# EAGLE design PCM2906_SPDIF_Converter (EAGLE 7.4.0)
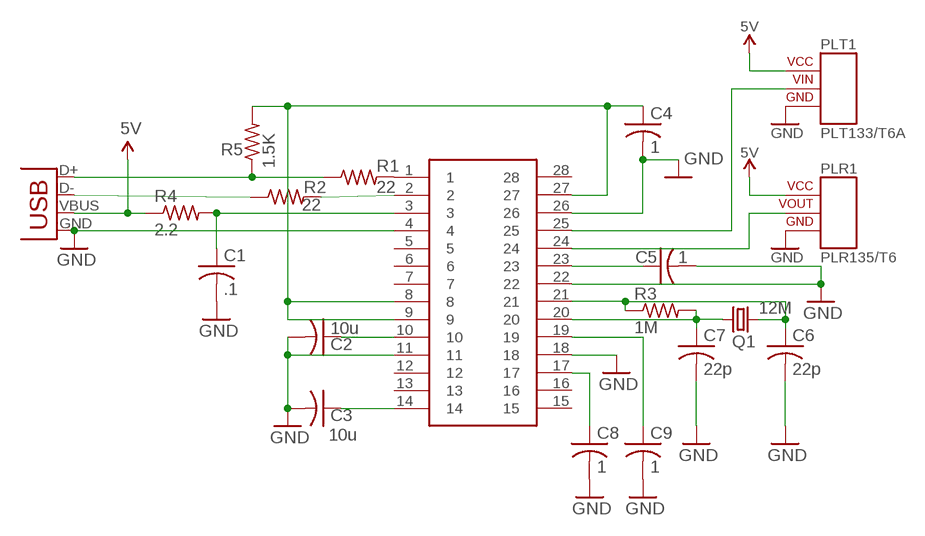
[diagram p0: schematic, sheet 1]

## Parts
C1  .1  C-USC0805  [C0805]
C2  10u  C-USC1210  [C1210]
C3  10u  C-USC1210  [C1210]
C4  1  C-USC1210  [C1210]
C5  1  C-USC1210  [C1210]
C6  22p  C-USC0805  [C0805]
C7  22p  C-USC0805  [C0805]
C8  1  C-USC1210  [C1210]
C9  1  C-USC1210  [C1210]
PCM2906  SSOP28  [SSOP28DB]
PLR1  PLR135/T6  [PLR135/T6]
PLT1  PLT133/T6A  [PLT133/T6A]
Q1  12M  CRYSTALHC49US  [HC49US]
R1  22  R-US_R0805  [R0805]
R2  22  R-US_R0805  [R0805]
R3  1M  R-US_R0805  [R0805]
R4  2.2  R-US_R0805  [R0805]
R5  1.5K  R-US_R0805  [R0805]
X2  USBSMD  [USB-MINIB]

## Nets
5V: PLR1.VCC PLT1.VCC R4.1 X2.VBUS
GND: C1.2 C2.2 C3.2 C4.2 C5.2 C6.2 C7.2 C8.2 C9.2 PCM2906.4 PCM2906.11 PCM2906.18 PCM2906.22 PCM2906.26 PLR1.GND PLT1.GND X2.GND
N$1: PCM2906.1 R1.2
N$2: PCM2906.2 R2.2
N$3: C6.1 PCM2906.21 Q1.2 R3.1
N$4: R1.1 R5.1 X2.D+
N$5: R2.1 X2.D-
N$7: PCM2906.24 PLR1.VOUT
N$8: C4.1 PCM2906.8 PCM2906.9 PCM2906.27 R5.2
N$9: C5.1 PCM2906.23
N$10: C2.1 PCM2906.10
N$11: C3.1 PCM2906.14
N$12: C1.1 PCM2906.3 R4.2
N$13: PCM2906.25 PLT1.VIN
N$14: C8.1 PCM2906.17
N$16: C9.1 PCM2906.19
N$19: C7.1 PCM2906.20 Q1.1 R3.2
Unconnected: PCM2906.5 PCM2906.6 PCM2906.7 PCM2906.12 PCM2906.13 PCM2906.15 PCM2906.16 PCM2906.28

## Library data of the parts
C1-C9 = resistor:C-US: CAPACITOR, American symbol
PCM2906 = SparkFun:SSOP28
PLR1 = Joseph_Optoelectronics:PLR135/T6
PLT1 = Joseph_Optoelectronics:PLT133: Photo-link Light Transmitter Unit www.everlight.com Replacement for the PLT133/T6A
Q1 = SparkFun:CRYSTAL: Crystals Various standard crystals. Proven footprints. Spark Fun Electronics SKU : COM-00534
R1-R5 = resistor:R-US_: RESISTOR, American symbol
X2 = SparkFun:USB: USB Connectors USB-B-PTH is fully proven SKU : PRT-00139 USB-miniB is fully proven SKU : PRT-00587 USB-A-PCB is untested. USB-A-H is throughly reviewed, but untested. Spark Fun Electronics SKU : PRT-00437 USB-B-SMT is throughly reviewed, but untested. Needs silkscreen touching up. USB-A-S has not been used/tested USB-MB-H has not been used/tested

## Board
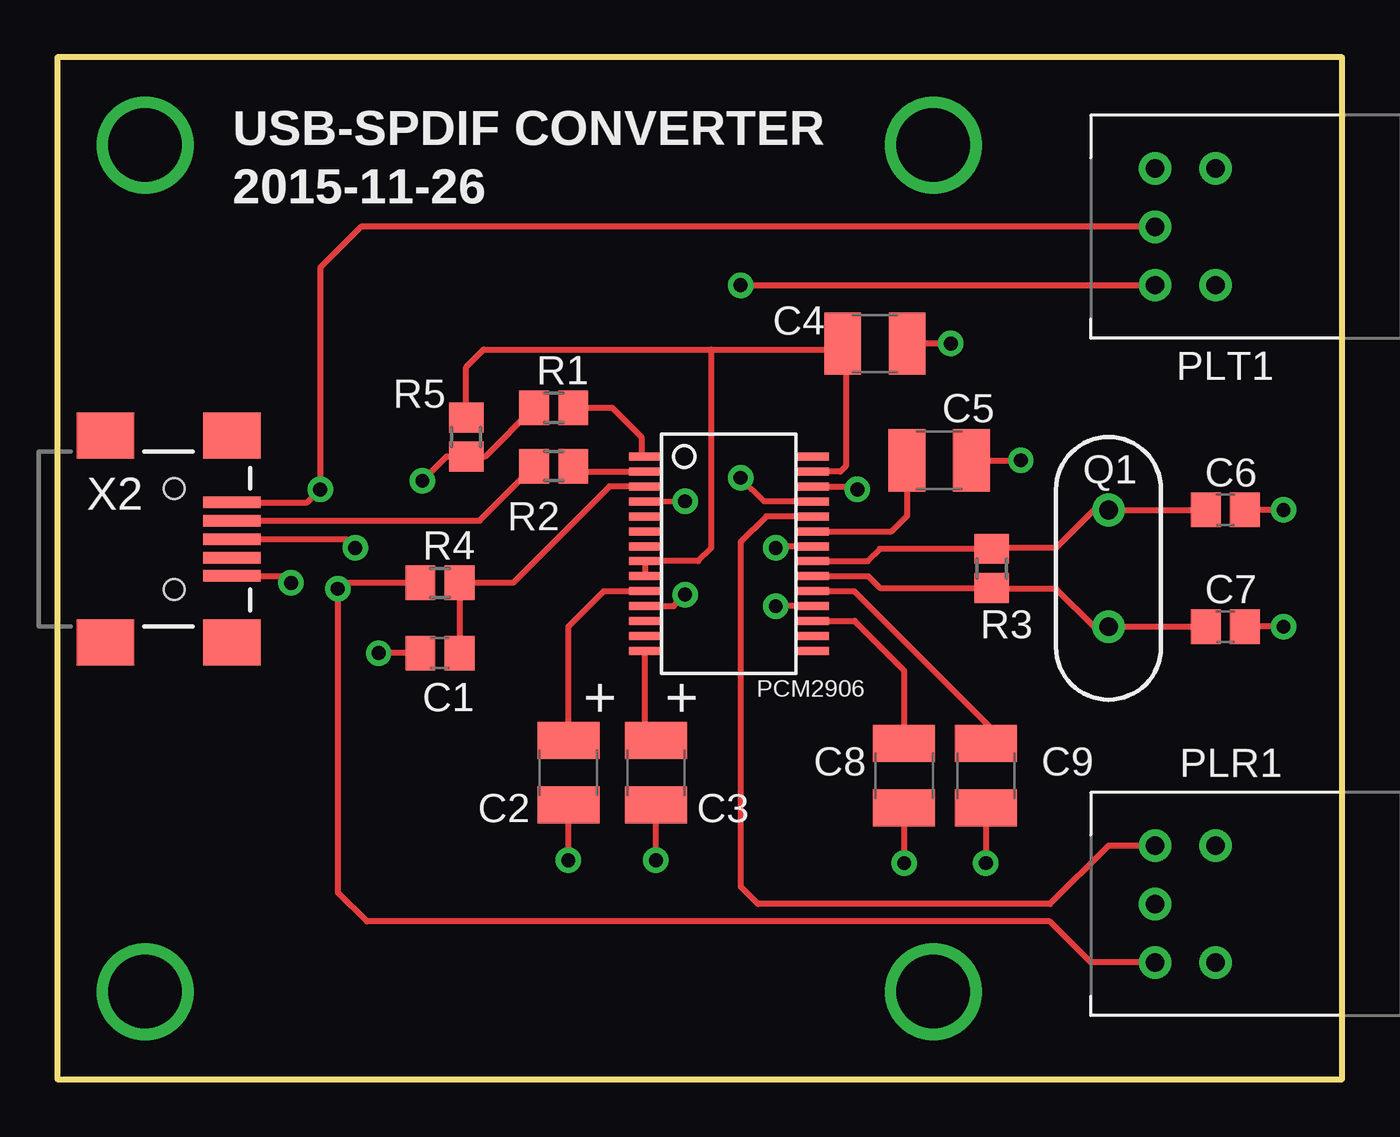
[diagram p1: board, top side]
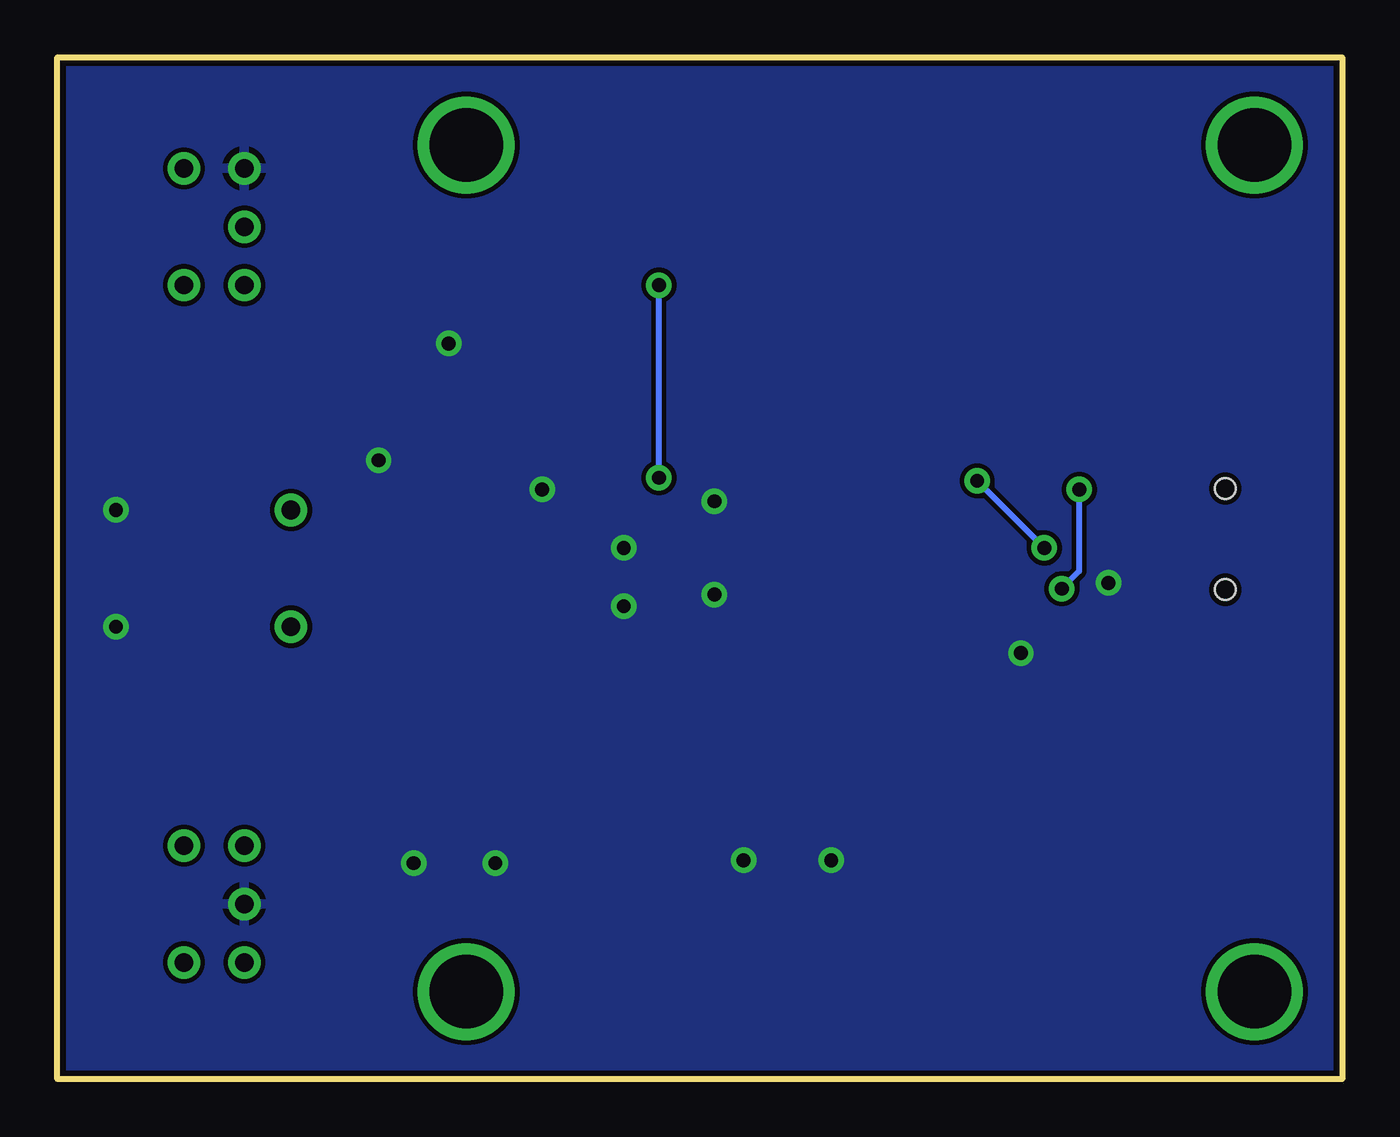
[diagram p2: board, bottom side, seen from below]

Size 55.88 x 44.45 mm. Coordinates in mm from the lower left corner, seen from the top.
Outline: 0,0 55.88,0 55.88,44.45 0,44.45 0,0
Copper layers (1*16): Top 0.035mm / dielectric 1.5mm / Bottom 0.035mm
Design rules "SparkFun": minimum track width 8mil, minimum drill 20mil, track to track 8mil, track to pad 8mil, pad to pad 8mil, via to via 8mil, smd to smd 8mil, copper to edge 10mil, drill to drill 8mil, minimum pad ring 12mil, minimum via ring 10mil, stop-mask expansion 4mil, vias tented up to drill 25mil, thermal gap 10mil

### Footprints (pad centres in the part's own frame; a part is rotated, then mirrored left to right if it is on the bottom)
C0805 = smd 1.3 x 1.5: 1 -0.85,0; 2 0.85,0
C1210 = smd 1.6 x 2.7: 1 -1.4,0; 2 1.4,0
SSOP28DB = smd 0.348 x 1.397: 1 -4.225,-3.656; 2 -3.575,-3.656; 3 -2.925,-3.656; 4 -2.275,-3.656; 5 -1.625,-3.656; 6 -0.975,-3.656; 7 -0.325,-3.656; 8 0.325,-3.656; 9 0.975,-3.656; 10 1.625,-3.656; 11 2.275,-3.656; 12 2.925,-3.656; 13 3.575,-3.656; 14 4.225,-3.656; 15 4.225,3.656; 16 3.575,3.656; 17 2.925,3.656; 18 2.275,3.656; 19 1.625,3.656; 20 0.975,3.656; 21 0.325,3.656; 22 -0.325,3.656; 23 -0.975,3.656; 24 -1.625,3.656; 25 -2.275,3.656; 26 -2.925,3.656; 27 -3.575,3.656; 28 -4.225,3.656
PLR135/T6 = drill 0.8: GND 0,0; P$4 -2.54,2.625; P$5 2.54,2.625; VCC 2.54,0; VOUT -2.54,0
PLT133/T6A = drill 0.8: GND -2.54,0; P$1 -2.54,2.625; P$4 -2.54,2.625; P$5 2.54,2.625; VCC 0,0; VIN 2.54,0
HC49US = drill 0.813: 1 -2.54,0; 2 2.54,0
R0805 = smd 1.3 x 1.5: 1 -0.85,0; 2 0.85,0
USB-MINIB = smd 2.5 x 0.5: D+ 2.5,0; D- 2.5,0.8; GND 2.5,-1.6; ID 2.5,-0.8; VBUS 2.5,1.6 | smd 2.5 x 2: GND@1 -3,-4.5; GND@2 -3,4.5; GND@3 2.5,4.5; GND@4 2.5,-4.5 | hole 0.9: 0,2.2; 0,-2.2

### Placement (x,y rotation side)
C1  16.64,18.54 180 top
C2  22.23,13.34 270 top
C3  26.04,13.34 270 top
C4  35.56,32 0 top
C5  38.35,26.92 0 top
C6  50.8,24.77 0 top
C7  50.8,19.68 0 top
C8  36.83,13.21 270 top
C9  40.39,13.21 270 top
PCM2906  29.21,22.86 270 top
PLR1  47.75,7.62 270 top
PLT1  47.75,37.08 270 top
Q1  45.72,22.23 90 top
R1  21.59,29.21 0 top
R2  21.59,26.67 0 top
R3  40.64,22.23 270 top
R4  16.64,21.59 0 top
R5  17.78,27.94 90 top
X2  5.08,23.5 0 top

### Tracks (layer width: path | path; a pad name or v marks a point on that pad's centre or on a via)
5V  (via drill 0.6)
  Top 0.254: X2.VBUS 10.87,25.09 v11.43,25.65 11.43,35.31 13.21,37.08 PLT1.VCC | R4.1 12.45,21.59 v12.19,21.34 12.19,8.13 13.46,6.86 43.18,6.86 44.96,5.08 PLR1.VCC
  Bottom 0.254: v11.43,25.65 11.43,22.1 v12.19,21.34
GND  (via drill 0.6)
  Top 0.254: v53.34,24.77 C6.2 | v53.34,19.68 C7.2 | X2.GND 9.86,21.89 v10.16,21.59 | C8.2 v36.83,9.4 | C9.2 v40.39,9.4 | v22.23,9.53 C2.2 | v26.04,9.53 C3.2 | PCM2906.4 26.3,25.14 v27.3,25.15 | PCM2906.11 26.81,20.59 v27.3,21.08 | v38.86,32 C4.2 | PCM2906.26 34.67,25.79 v34.8,25.65 | PCM2906.22 31.31,23.18 v31.24,23.11 | PCM2906.18 31.25,20.59 v31.24,20.57 | C5.2 v41.91,26.92 | C1.2 v13.97,18.54
  pour Bottom: 0,44.45 55.88,44.45 55.88,0 0,0
N$1
  Top 0.254: R1.2 24.13,29.21 25.4,27.94 25.4,27.24 PCM2906.1
N$2
  Top 0.254: PCM2906.2 22.68,26.43 arc-90 R2.2
N$3
  Top 0.254: 40.42,22.86 R3.1 40.13,23.07 | PCM2906.21 35.23,22.54 35.77,23.07 40.13,23.07 | C6.1 Q1.2 45.09,24.77 43.43,23.11 40.17,23.11 40.13,23.07
N$4  (via drill 0.6)
  Top 0.254: R1.1 18.62,27.09 R5.1 16.93,27.09 v15.88,26.04 | X2.D+ 12.57,23.5 v12.95,23.11
  Bottom 0.254: v12.95,23.11 v15.88,26.04
N$5
  Top 0.254: X2.D- 18.36,24.3 R2.1
N$7
  Top 0.254: PCM2906.24 30.84,24.48 29.72,23.37 29.72,8.38 30.48,7.62 43.18,7.62 45.72,10.16 PLR1.VOUT
N$8
  Top 0.254: PCM2906.9 PCM2906.8 27.87,22.54 28.45,23.11 28.45,31.75 | 34.29,31.75 34.29,26.67 34.05,26.43 PCM2906.27 | 34.29,31.75 C4.1 | R5.2 17.78,30.99 18.54,31.75 28.45,31.75 | 28.45,31.75 34.29,31.75
N$9
  Top 0.254: C5.1 36.95,24.51 36.28,23.84 PCM2906.23
N$10
  Top 0.254: PCM2906.10 23.77,21.23 22.23,19.68 C2.1
N$11
  Top 0.254: PCM2906.14 25.55,15.22 C3.1
N$12
  Top 0.254: PCM2906.3 24.01,25.79 19.81,21.59 R4.2 C1.1
N$13  (via drill 0.6)
  Top 0.254: PCM2906.25 30.75,25.14 v29.72,26.16 | v29.72,34.54 PLT1.VIN
  Bottom 0.254: v29.72,26.16 v29.72,34.54
N$14
  Top 0.254: PCM2906.17 34.67,19.93 36.83,17.78 C8.1
N$16
  Top 0.254: PCM2906.19 34.65,21.23 40.64,15.24 C9.1
N$17  (via drill 3.2)
  other vias: 3.81,3.81
N$18  (via drill 3.2)
  other vias: 3.81,40.64
N$19
  Top 0.254: PCM2906.20 35.27,21.89 35.77,21.38 R3.2 40.68,21.34 43.43,21.34 45.09,19.68 Q1.1 C7.1
N$20  (via drill 3.2)
  other vias: 38.1,40.64
N$23  (via drill 3.2)
  other vias: 38.1,3.81

### Text on the board
tPlace: USB-SPDIF CONVERTER | 2015-11-26
tNames: + | +